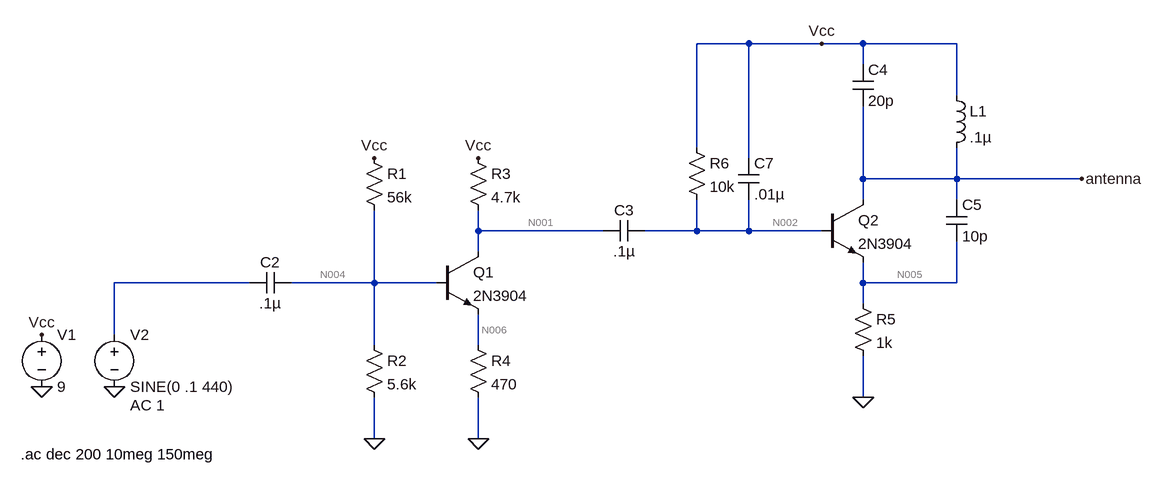
[diagram p0: schematic l7.asc]
l7.asc, the LTspice schematic file:
Version 4
SHEET 1 1500 680
WIRE 608 -224 528 -224
WIRE 720 -224 608 -224
WIRE 784 -224 720 -224
WIRE 928 -224 784 -224
WIRE 784 -192 784 -224
WIRE 928 -144 928 -224
WIRE 528 -64 528 -224
WIRE 608 -48 608 -224
WIRE 784 -16 784 -128
WIRE 928 -16 928 -64
WIRE 928 -16 784 -16
WIRE 1120 -16 928 -16
WIRE 784 16 784 -16
WIRE 928 16 928 -16
WIRE 192 64 192 32
WIRE 384 64 192 64
WIRE 528 64 528 16
WIRE 528 64 448 64
WIRE 608 64 608 16
WIRE 608 64 528 64
WIRE 720 64 608 64
WIRE 192 96 192 64
WIRE -160 144 -368 144
WIRE 32 144 32 32
WIRE 32 144 -96 144
WIRE 128 144 32 144
WIRE 784 144 784 112
WIRE 928 144 928 80
WIRE 928 144 784 144
WIRE 784 176 784 144
WIRE -368 224 -368 144
WIRE 32 240 32 144
WIRE 192 240 192 192
WIRE 784 320 784 256
WIRE 32 384 32 320
WIRE 192 384 192 320
FLAG 192 384 0
FLAG 32 384 0
FLAG -480 224 Vcc
FLAG 32 -48 Vcc
FLAG 192 -48 Vcc
FLAG -480 304 0
FLAG -368 304 0
FLAG 720 -224 Vcc
FLAG 784 320 0
FLAG 1120 -16 antenna
SYMBOL npn 128 96 R0
SYMATTR InstName Q1
SYMATTR Value 2N3904
SYMBOL res 16 -64 R0
SYMATTR InstName R1
SYMATTR Value 56k
SYMBOL res 16 224 R0
SYMATTR InstName R2
SYMATTR Value 5.6k
SYMBOL res 176 -64 R0
SYMATTR InstName R3
SYMATTR Value 4.7k
SYMBOL res 176 224 R0
SYMATTR InstName R4
SYMATTR Value 470
SYMBOL cap -96 128 R90
WINDOW 0 0 32 VBottom 2
WINDOW 3 32 32 VTop 2
SYMATTR InstName C2
SYMATTR Value .1µ
SYMBOL cap 448 48 R90
WINDOW 0 0 32 VBottom 2
WINDOW 3 32 32 VTop 2
SYMATTR InstName C3
SYMATTR Value .1µ
SYMBOL voltage -480 208 R0
WINDOW 123 0 0 Left 0
WINDOW 39 0 0 Left 0
SYMATTR InstName V1
SYMATTR Value 9
SYMBOL voltage -368 208 R0
WINDOW 123 24 124 Left 2
WINDOW 39 0 0 Left 0
SYMATTR Value2 AC 1
SYMATTR InstName V2
SYMATTR Value SINE(0 .1 440)
SYMBOL npn 720 16 R0
SYMATTR InstName Q2
SYMATTR Value 2N3904
SYMBOL res 768 160 R0
SYMATTR InstName R5
SYMATTR Value 1k
SYMBOL cap 768 -192 R0
SYMATTR InstName C4
SYMATTR Value 20p
SYMBOL cap 912 16 R0
SYMATTR InstName C5
SYMATTR Value 10p
SYMBOL ind 912 -160 R0
SYMATTR InstName L1
SYMATTR Value .1µ
SYMBOL cap 592 -48 R0
SYMATTR InstName C7
SYMATTR Value .01µ
SYMBOL res 512 -80 R0
SYMATTR InstName R6
SYMATTR Value 10k
TEXT -512 408 Left 2 !.ac dec 200 10meg 150meg

The netlist it stands for:
* l7.asc
Q1 N001 N004 N006 0 2N3904
R1 Vcc N004 56k
R2 N004 0 5.6k
R3 Vcc N001 4.7k
R4 N006 0 470
C2 N004 N003 .1µ
C3 N002 N001 .1µ
V1 Vcc 0 9
V2 N003 0 SINE(0 .1 440) AC 1
Q2 antenna N002 N005 0 2N3904
R5 N005 0 1k
C4 Vcc antenna 20p
C5 antenna N005 10p
L1 Vcc antenna .1µ
C7 Vcc N002 .01µ
R6 Vcc N002 10k
.model NPN NPN
.model PNP PNP
.lib standard.bjt
.ac dec 200 10meg 150meg
.backanno
.end

* Results of the author's LTspice run, read from the files saved beside the schematic
* Operating Point, zero values left out:
*   V(n001) = 7.177 V
*   V(n004) = 812 mV
*   V(n006) = 182.9 mV
*   V(vcc) = 9 V
*   V(n002) = 8.729 V
*   V(antenna) = 9 V
*   V(n005) = 8.018 V
*   Ic(Q2) = 7.991 mA
*   Ib(Q2) = 27.1 µA
*   Ie(Q2) = -8.018 mA
*   Ic(Q1) = 387.9 µA
*   Ib(Q1) = 1.217 µA
*   Ie(Q1) = -389.1 µA
*   I(L1) = 7.991 mA
*   I(R6) = 27.1 µA
*   I(R5) = 8.018 mA
*   I(R4) = 389.1 µA
*   I(R3) = 387.9 µA
*   I(R2) = 145 µA
*   I(R1) = 146.2 µA
*   I(V1) = -8.552 mA